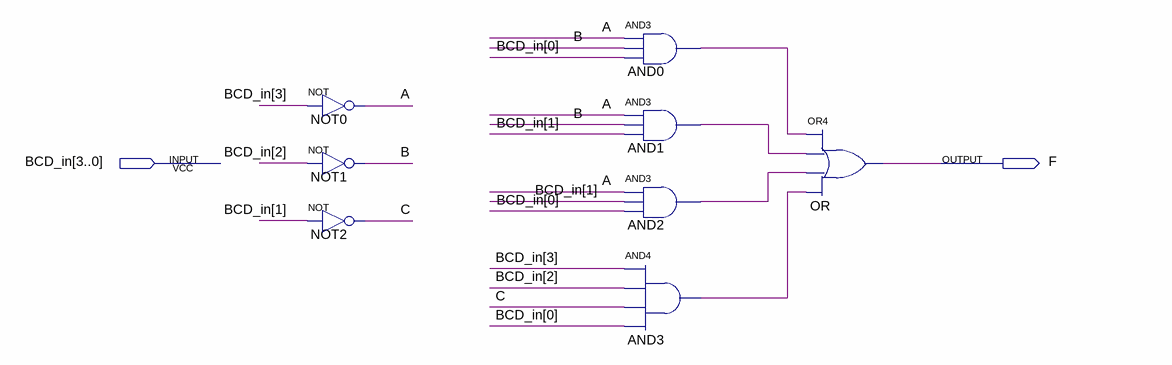
[diagram p0: schematic sheet]
// Quartus schematic DECOD_BCD_F.bdf as structural Verilog: 8 symbols, 2 pins
module DECOD_BCD_F (
  input  [3:0] BCD_in,
  output F
);

  wire A, AND0_out, AND1_out, AND2_out, AND3_out, B, C;

  not NOT0 (A, BCD_in[3]);
  not NOT1 (B, BCD_in[2]);
  not NOT2 (C, BCD_in[1]);
  and AND0 (AND0_out, A, B, BCD_in[0]);
  and AND1 (AND1_out, A, B, BCD_in[1]);
  and AND2 (AND2_out, A, BCD_in[1], BCD_in[0]);
  and AND3 (AND3_out, BCD_in[3], BCD_in[2], C, BCD_in[0]);
  or OR (F, AND0_out, AND1_out, AND2_out, AND3_out);
endmodule
